# EAGLE schematic controller (EAGLE 6.4)
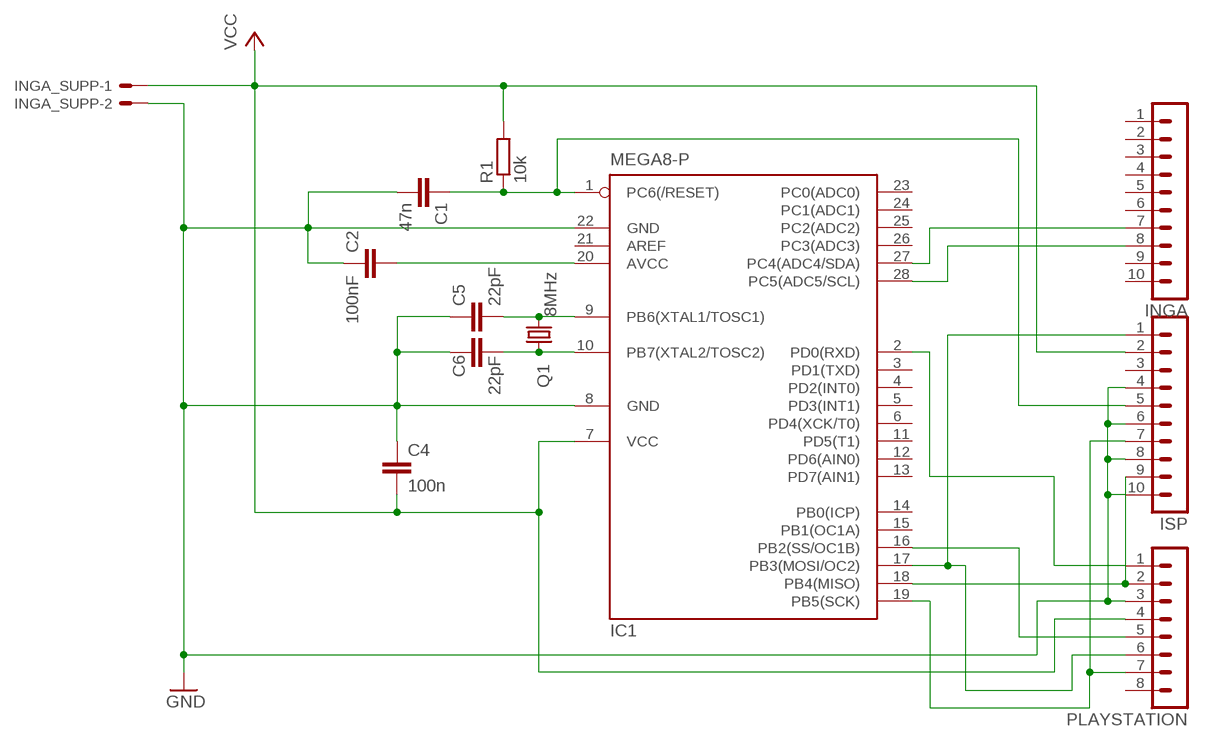
[diagram p0: schematic, sheet 1]

## Parts
C1  47n  C2,5-3  [C2.5-3]
C2  100nF  C2,5-3  [C2.5-3]
C4  100n  C2,5-3  [C2.5-3]
C5  22pF  C2,5-3  [C2.5-3]
C6  22pF  C2,5-3  [C2.5-3]
IC1  MEGA8-P  [DIL28-3]
INGA  MA10-1  [MA10-1]
INGA_SUPP  22-23-2021  [22-23-2021]
ISP  MA10-1  [MA10-1]
PLAYSTATION  MA08-1  [MA08-1]
Q1  8MHz  CRYSTALHC49U70  [HC49U70]
R1  10k  R-EU_0207/10  [0207/10]

## Nets
GND: C1.2 C2.1 C4.1 C5.1 C6.1 IC1.8(GND) IC1.22(GND) INGA_SUPP.2 ISP.4 ISP.6 ISP.8 ISP.10 PLAYSTATION.3
N$1: C5.2 IC1.9(PB6(XTAL1/TOSC1)) Q1.2
N$2: C1.1 IC1.1(PC6(/RESET)) ISP.5 R1.1
N$3: IC1.19(PB5(SCK)) ISP.7 PLAYSTATION.7
N$4: C2.2 IC1.20(AVCC)
N$5: C6.2 IC1.10(PB7(XTAL2/TOSC2)) Q1.1
N$6: IC1.17(PB3(MOSI/OC2)) ISP.1 PLAYSTATION.6
N$7: IC1.18(PB4(MISO)) ISP.9 PLAYSTATION.2
N$8: IC1.28(PC5(ADC5/SCL)) INGA.8
N$9: IC1.27(PC4(ADC4/SDA)) INGA.7
N$10: IC1.2(PD0(RXD)) PLAYSTATION.1
PLAYSTATION: IC1.16(PB2(SS/OC1B)) PLAYSTATION.5
VCC: C4.2 IC1.7(VCC) INGA_SUPP.1 ISP.2 PLAYSTATION.4 R1.2
Unconnected: IC1.3(PD1(TXD)) IC1.4(PD2(INT0)) IC1.5(PD3(INT1)) IC1.6(PD4(XCK/T0)) IC1.11(PD5(T1)) IC1.12(PD6(AIN0)) IC1.13(PD7(AIN1)) IC1.14(PB0(ICP)) IC1.15(PB1(OC1A)) IC1.21(AREF) IC1.23(PC0(ADC0)) IC1.24(PC1(ADC1)) IC1.25(PC2(ADC2)) IC1.26(PC3(ADC3)) INGA.1 INGA.2 INGA.3 INGA.4 INGA.5 INGA.6 INGA.9 INGA.10 ISP.3 PLAYSTATION.8

## Library data of the parts
C1 C2 C4-C6 = capacitor-wima:C: CAPACITOR naming: grid - package width
IC1 = atmel:MEGA8-P: MICROCONTROLLER 8 Kbytes FLASH, 1 kbytes SRAM, 512 bytes EEPROM, USART, 4-channel 10 bit ADC, 2-channel 8 bit ADC Pin compatible with Atmega48, ATMega88, ATMega168 Source: avr.lbr; OC_FARNELL: unknown; OC_NEWARK: unknown
INGA ISP = con-lstb:MA10-1: PIN HEADER; OC_FARNELL: unknown; OC_NEWARK: unknown
INGA_SUPP = con-molex:22-23-2021: .100" (2.54mm) Center Header - 2 Pin; MF: MOLEX; MPN: 22-23-2021; OC_FARNELL: 1462926; OC_NEWARK: 25C3832
PLAYSTATION = con-lstb:MA08-1: PIN HEADER; OC_FARNELL: unknown; OC_NEWARK: unknown
Q1 = crystal:CRYSTAL: CRYSTAL; OC_FARNELL: unknown; OC_NEWARK: unknown
R1 = resistor:R-EU_: RESISTOR, European symbol